# EAGLE design Valve (EAGLE 9.5.2)
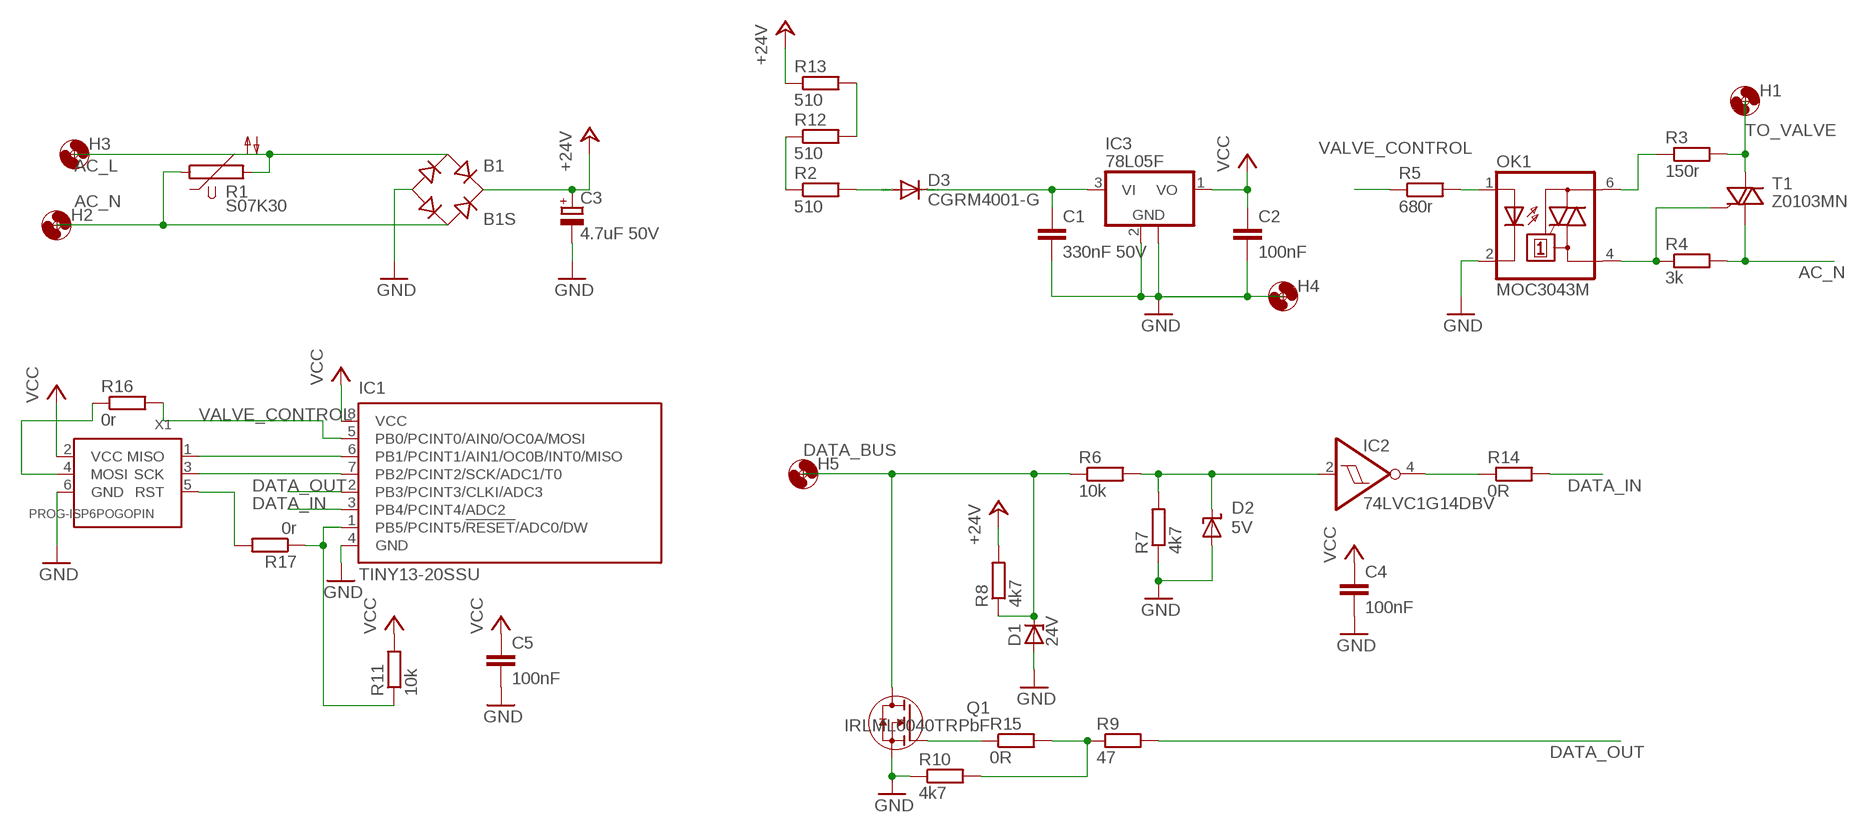
[diagram p0: schematic, sheet 1]

## Parts
B1  B1S  [MBS]
C1  330nF 50V  C-EUC0805K  [C0805K]
C2  100nF  C-EUC0805K  [C0805K]
C3  4.7uF 50V  CPOL-EUD/7343-31R  [D/7343-31R]
C4  100nF  C0805  [0805]
C5  100nF  C-EUC0805K  [C0805K]
D1  24V  ZENER-DIODESOT23  [SOT23]
D2  5V  ZENER  [SOD123]
D3  CGRM4001-G  [SOD-123_MINI-SMA]
H1  MOUNT-HOLE3.0  [3,0]
H2  MOUNT-HOLE3.0  [3,0]
H3  MOUNT-HOLE3.0  [3,0]
H4  MOUNT-HOLE3.0  [3,0]
H5  MOUNT-HOLE3.0  [3,0]
IC1  TINY13-20SSU  [8S1]
IC2  74LVC1G14DBV  [SOT23-5]
IC3  78L05F  [SOT89]
OK1  MOC3043M  [DIL06]
Q1  IRLML0040TRPbF  SI2302  [SOT-23-GSD]
R1  S07K30  S07K40  [S07K40]
R2  510  R-EU_R2512  [R2512]
R3  150r  R-EU_R0805  [R0805]
R4  3k  R-EU_R0805  [R0805]
R5  680r  R-EU_R0805  [R0805]
R6  10k  R-EU_R0805  [R0805]
R7  4k7  R-EU_R0805  [R0805]
R8  4k7  R-EU_R0805  [R0805]
R9  47  R-EU_R0805  [R0805]
R10  4k7  R-EU_R0805  [R0805]
R11  10k  R-EU_R0805  [R0805]
R12  510  R-EU_R2512  [R2512]
R13  510  R-EU_R2512  [R2512]
R14  0R  R-EU_R1206W  [R1206W]
R15  0R  R-EU_R1206W  [R1206W]
R16  0r  R0805  [0805R]
R17  0r  R0805  [0805R]
T1  Z0103MN  [SOT223]
X1  PROG-ISP6POGOPIN  [PROG_POGOPIN]

## Nets
+24V: B1.+ C3.+ R8.2 R13.1
AC_L: B1.AC1 H3.P$1 R1.2
AC_N: B1.AC2 H2.P$1 R1.1 R4.2 T1.1(A1)
DATA_BUS: D1.3(C) H5.P$1 Q1.D R6.1 R8.1
DATA_IN: IC1.3(PB4/PCINT4/ADC2) R14.2
DATA_OUT: IC1.2(PB3/PCINT3/CLKI/ADC3) R9.2
GND: B1.- C1.2 C2.2 C3.- C4.2 C5.2 D1.1(A) D2.A H4.P$1 IC1.4(GND) IC3.2(GND) IC3.2@1(GND) OK1.2(C) Q1.S R7.1 R10.1 X1.6(GND)
N$1: C1.1 D3.C IC3.3(VI)
N$2: D3.A R2.2
N$3: R12.2 R13.2
N$4: OK1.4(A1) R4.1 T1.3(G)
N$5: R2.1 R12.1
N$6: D2.C IC2.2(I) R6.2 R7.2
N$7: R9.1 R10.2 R15.2
N$8: IC1.1(PB5/PCINT5/!RESET!/ADC0/DW) R11.1 R17.1
N$9: IC2.4(O) R14.1
N$10: IC1.6(PB1/PCINT1/AIN1/OC0B/INT0/MISO) X1.1(MISO)
N$11: IC1.7(PB2/PCINT2/SCK/ADC1/T0) X1.3(SCK)
N$12: Q1.G R15.1
N$13: R16.1 X1.4(MOSI)
N$14: R17.2 X1.5(RST)
N$15: OK1.1(A) R5.2
N$16: OK1.6(A2) R3.1
TO_VALVE: H1.P$1 R3.2 T1.2(A2) T1.4(A2)
VALVE_CONTROL: IC1.5(PB0/PCINT0/AIN0/OC0A/MOSI) R5.1 R16.2
VCC: C2.1 C4.1 C5.1 IC1.8(VCC) IC3.1(VO) R11.2 X1.2(VCC)

## Power pins joined to a net without a drawn wire
GND: IC2.3(GND)
VCC: IC2.5(VCC)

## Library data of the parts
B1 = rectifier:B*S: Surface Mount Glass Passivated Bridge Rectifiers Source: Comchip Bridge Rectifiers B05S-G_B10S-G.pdf
C1 C2 C5 = rcl:C-EU: CAPACITOR, European symbol
C3 = rcl:CPOL-EU: POLARIZED CAPACITOR, European symbol
C4 = usb:C0805
D1 = diode:ZENER-DIODE: Z-Diode
D2 = usb:ZENER
D3 = diode:CGRM400*-G: Molded plasitc,JEDEC SOD-123/Mini SMA Source: Comchip CGRM4001-G.pdf
H1-H5 = holes:MOUNT-HOLE: MOUNTING HOLE with drill center marker
IC1 = atmel:TINY13: 8-bit AVR Microcontroller with 1K Bytes In-System Programmable Flash Source: http://www.atmel.com/dyn/resources/prod_documents/2535S.pdf; MPN: ATTINY13-20SSU; OC_FARNELL: 1455133; OC_NEWARK: 58M3771
IC2 = 74xx-little-de:74*1G14: Single Schmitt-Trigger Inverter Gate
IC3 = linear:78L*: POSITOIV-VOLTAGE REGULATORS Output up to 100 mA Source: Datasheet <http://focus.ti.com/lit/ds/symlink/ua78l05.pdf>
OK1 = optocoupler:MOC30*: 6-Pin DIP Zero-Cross Optoisolators Triac Driver Output (250/400 Volt Peak) Source: Data sheet <http://www.fairchildsemi.com/ds/MO/MOC3031M.pdf> The old path of data sheet not more available 2013-05-06.; MF: FAIRCHILD SEMICONDUCTOR; MPN: MOC3043-M; OC_FARNELL: 1021371; OC_NEWARK: 72K8900
Q1 = usb:SI2302: N-канальный полевик
R1 = varistor:S07K40: VARISTOR
R2-R15 = rcl:R-EU_: RESISTOR, European symbol
R16 R17 = usb:R0805
T1 = usb:Z0103MN
X1 = usb:PROG-ISP

## Board
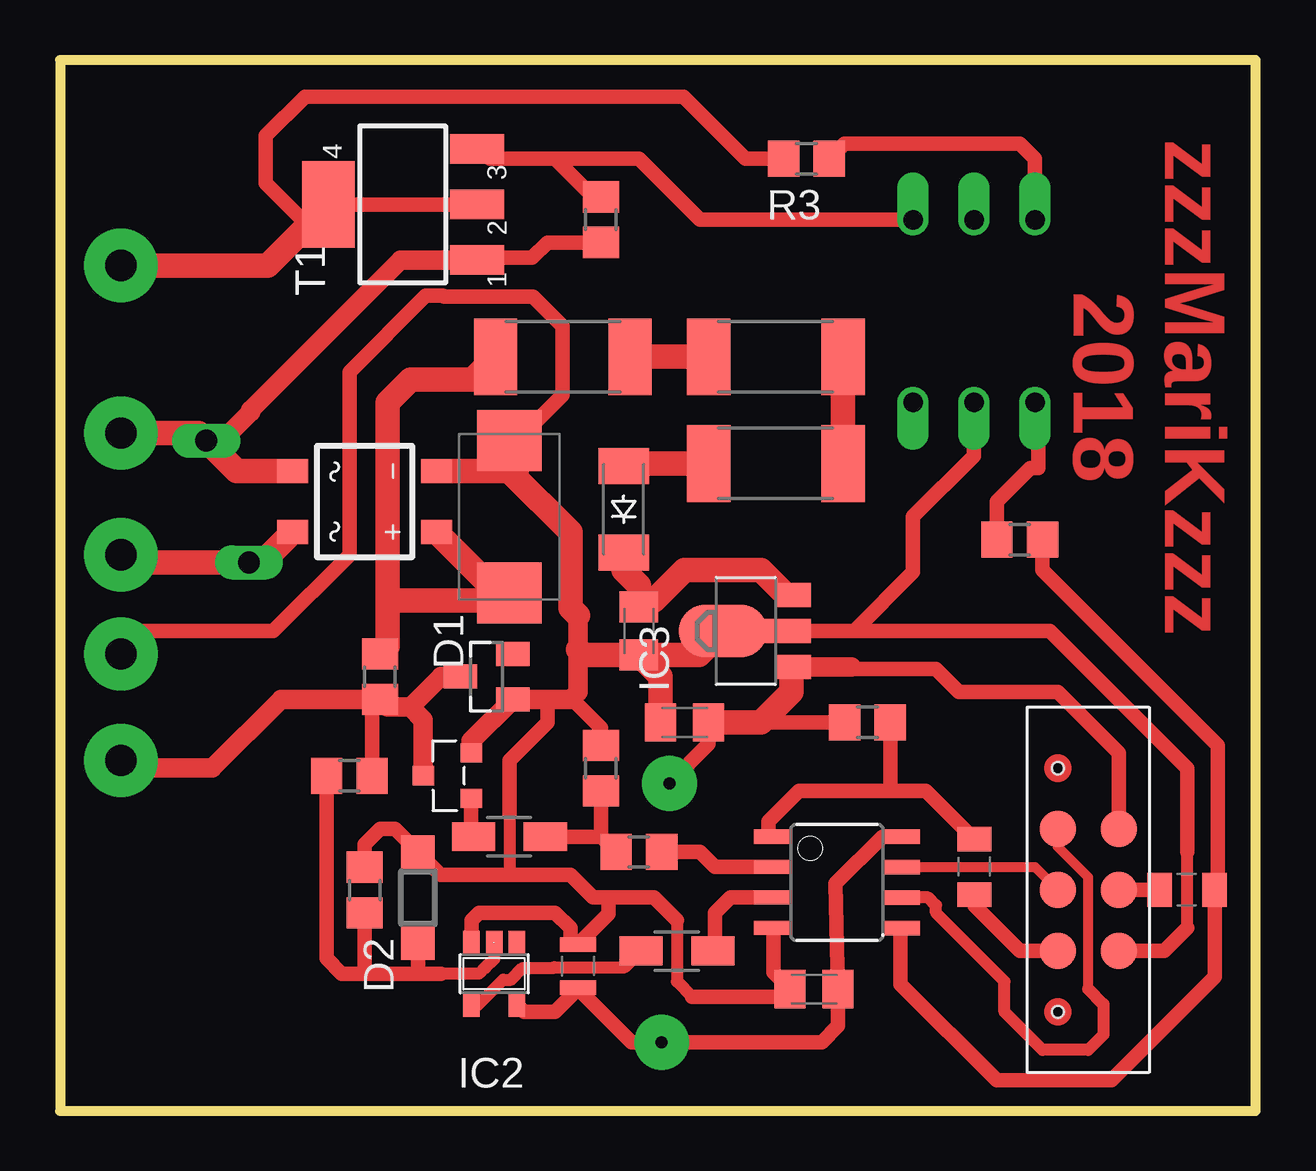
[diagram p1: board, top side]
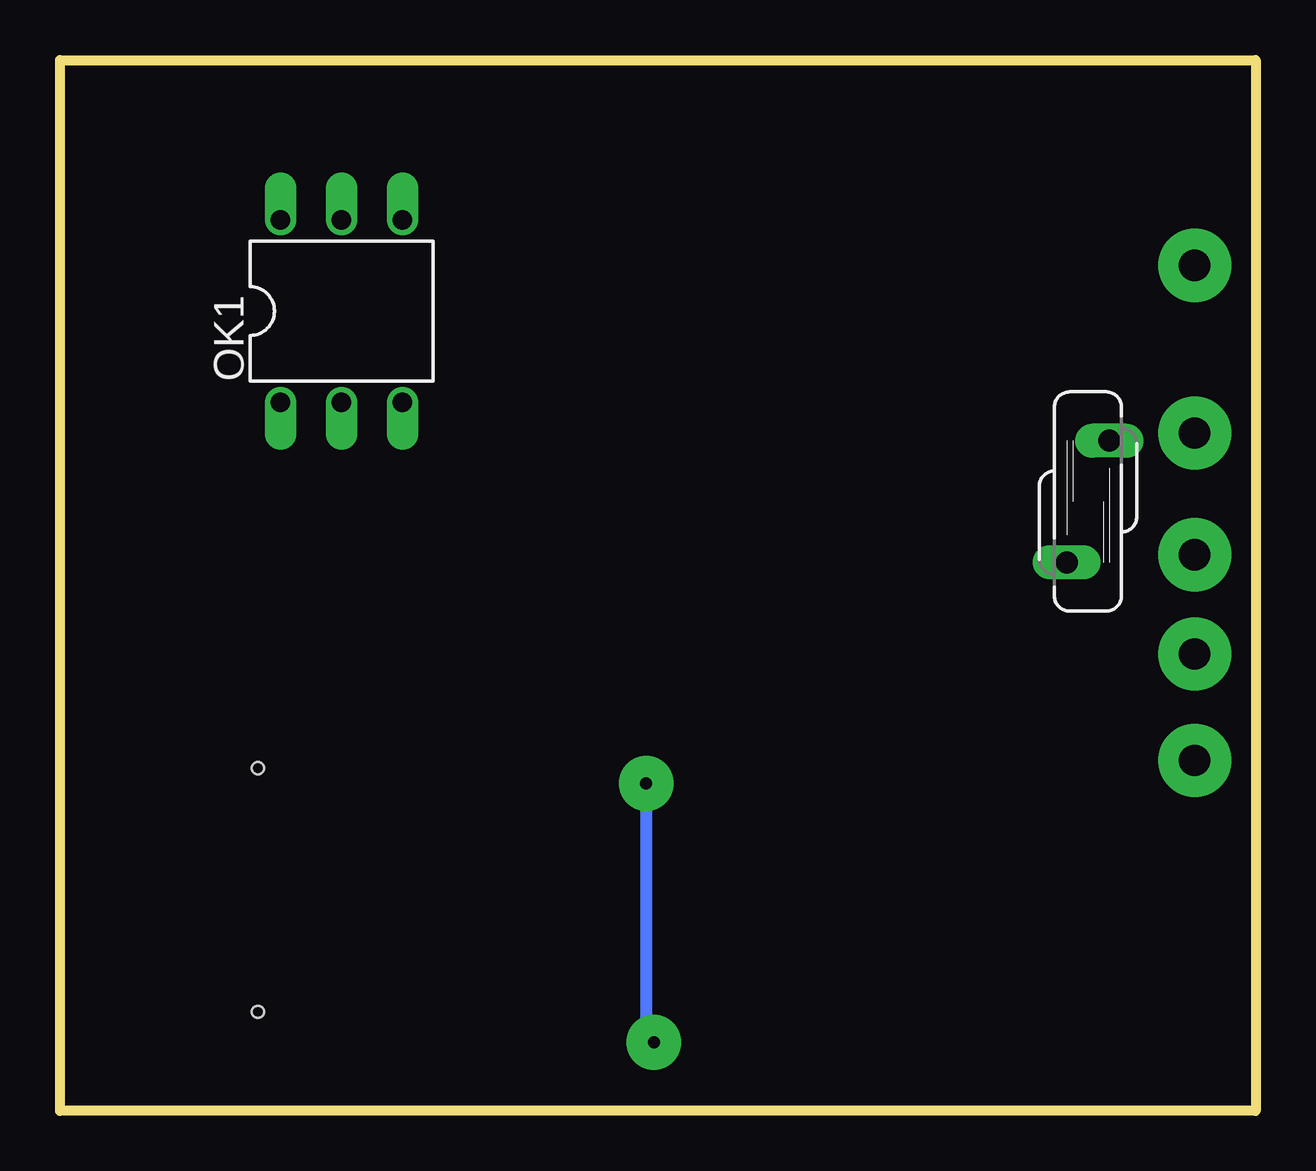
[diagram p2: board, bottom side, seen from below]

Size 49.84 x 43.8 mm. Coordinates in mm from the lower left corner, seen from the top.
Outline: 0,0 49.84,0 49.84,43.8 0,43.8 0,0
Copper layers (1*16): Top 0.035mm / dielectric 1.5mm / Bottom 0.035mm
Design rules "My": minimum track width 16mil, minimum drill 0.35mm, track to track 12mil, track to pad 12mil, pad to pad 12mil, via to via 12mil, smd to smd 12mil, copper to edge 40mil, drill to drill 24mil, minimum pad ring 10mil, minimum via ring 8mil, stop-mask expansion 4mil, vias tented up to drill 0mil, thermal gap 10mil

### Footprints (pad centres in the part's own frame; a part is rotated, then mirrored left to right if it is on the bottom)
MBS = smd 1 x 1.3: + -1.27,-3; - 1.27,-3; AC1 -1.27,3; AC2 1.27,3
C0805K = smd 1.3 x 1.6: 1 -1,0; 2 1,0
D/7343-31R = smd 2.55 x 2.7: + 3.175,0; - -3.175,0
0805 = smd 0.6 x 1.5: 1 -0.9,0; 2 0.9,0
SOT23 = smd 1 x 1.4: 1 -0.95,-1.1; 2 0.95,-1.1; 3 0,1.1
SOD123 = smd 1.4 x 1.4: A 1.9,0; C -1.9,0
SOD-123_MINI-SMA = smd 1.5 x 2.1: A 1.8,0; C -1.8,0
3,0 = drill 1.3 pad 3.048: P$1 0,0
8S1 = smd 0.6 x 1.6: 1 -1.905,-2.654; 2 -0.645,-2.654; 3 0.625,-2.654; 4 1.895,-2.654; 5 1.905,2.654; 6 0.635,2.654; 7 -0.635,2.654; 8 -1.905,2.654
SOT23-5 = smd 0.69 x 0.99: 1 -0.95,-1.29; 2 0,-1.29; 3 0.95,-1.29; 4 0.95,1.3; 5 -0.95,1.3
SOT89 = smd 1 x 1.5: 1 -1.499,-1.981; 3 1.499,-1.981 | smd 1 x 2: 2 0,-1.727 | smd 2.2 x 3.7: 2@1 0,0.94
DIL06 = drill 0.813 offset: 1 -2.54,-3.81; 2 0,-3.81; 3 2.54,-3.81; 4 2.54,3.81; 5 0,3.81; 6 -2.54,3.81
SOT-23-GSD = smd 0.8 x 0.9: D 0,2; G -0.95,0; S 0.95,0
S07K40 = drill 0.914 long: 1 -0.889,-2.54; 2 0.889,2.54
R2512 = smd 1.8 x 3.2: 1 -2.8,0; 2 2.8,0
R0805 = smd 1.3 x 1.5: 1 -0.95,0; 2 0.95,0
R1206W = smd 1.8 x 1.2: 1 -1.499,0; 2 1.499,0
0805R = smd 1.016 x 1.422: 1 -1.16,0.01; 2 1.14,0.01
SOT223 = smd 1.219 x 2.235: 1 -2.311,-3.099; 2 0,-3.099; 3 2.311,-3.099 | smd 3.6 x 2.2: 4 0,3.099
PROG_POGOPIN = smd 1.524 x 1.524: 1 0,7.62; 2 2.54,7.62; 3 0,5.08; 4 2.54,5.08; 5 0,2.54; 6 2.54,2.54 | hole 0.5: 0,0; 0,10.16

### Placement (x,y rotation side)
B1  12.7,25.4 90 top
C1  24.13,20 270 top
C2  26.04,16.19 180 top
C3  18.73,24.77 270 top
C4  21.59,6.03 90 top
C5  31.43,5.08 180 top
D1  17.78,18.1 90 top
D2  14.92,8.89 90 top
D3  23.5,25.08 90 top
H1  2.54,35.24 0 top
H2  2.54,28.26 0 top
H3  2.54,23.18 0 top
H4  2.54,19.05 0 top
H5  2.54,14.61 0 top
IC1  32.38,9.53 270 top
IC2  18.1,5.71 180 top
IC3  28.57,20 90 top
OK1  38.1,33.34 0 bottom
Q1  17.14,13.97 90 top
R1  6.99,25.4 180 bottom
R2  29.84,26.99 180 top
R3  31.11,39.69 180 top
R4  22.54,37.15 270 top
R5  40.01,23.81 180 top
R6  12.06,13.97 180 top
R7  12.7,9.21 270 top
R8  13.34,18.1 90 top
R9  24.13,10.79 0 top
R10  22.54,14.29 270 top
R11  33.66,16.19 180 top
R12  29.84,31.43 180 top
R13  20.95,31.43 0 top
R14  25.72,6.67 0 top
R15  18.73,11.43 0 top
R16  46.99,9.21 0 top
R17  38.1,10.16 270 top
T1  14.29,37.78 90 top
X1  41.59,4.13 0 top

### Tracks (layer width: path | path; a pad name or v marks a point on that pad's centre or on a via)
+24V
  Top 0.61: R8.2 13.65,19.05 | 18.72,21.27 C3.+
  Top 1.016: 13.65,21.27 13.65,29.53 14.61,30.48 17.2,30.48 R13.1 | 13.65,21.27 13.65,19.36 R8.2 | 18.23,21.61 C3.+ | 13.65,21.27 17.89,21.27 18.23,21.61 | B1.+ 18.23,21.61
AC_L
  Top 1.016: B1.AC1 8.43,22.86 R1.2 2.86,22.86 H3.P$1
AC_N
  Top 0.61: R4.2 20.32,36.2 19.68,35.56 17.48,35.56 T1.1
  Top 0.813: T1.1 14.2,35.47 7.94,29.21 7.94,29.12 6.42,27.61
  Top 1.016: H2.P$1 5.78,28.26 R1.1 | R1.1 6.35,27.94 | B1.AC2 7.37,26.67 6.42,27.61 R1.1
DATA_BUS
  Top 0.61: R6.1 13.02,16.83 R8.1
  Top 0.813: D1.3 15.88,18.1 14.61,16.83 | 14.61,16.83 13.65,16.83 R8.1 9.21,17.15 6.35,14.29 2.86,14.29 H5.P$1 | Q1.D 15.14,16.29 14.61,16.83
DATA_IN
  Top 0.61: 27.22,6.9 R14.2 27.3,6.76 27.3,8.26 27.95,8.9 IC1.3
DATA_OUT
  Top 0.61: R9.2 26.67,10.79 27.3,10.16 IC1.2
GND
  Top 0.508: 25.72,7.94 25.72,5.4 26.35,4.76 | 46.99,7.62 46.99,10.79 | 18.73,12.38 18.73,9.84
  Top 0.61: 44.45,6.35 X1.6 46.04,6.67 46.99,7.62 | IC1.4 29.73,5.78 C5.2 30.11,4.76 26.35,4.76 | 46.99,10.79 46.99,14.27 41.26,20 33.11,20 | 18.73,12.38 18.73,14.61 20.32,16.19 20.32,16.92 20.54,17.15 | 22.86,8.89 22.23,8.89 21.27,9.84 18.73,9.84 15.87,9.84 D2.A 13.96,11.75 13.34,11.75 12.7,11.11 R7.1 | 22.86,8.89 24.77,8.89 25.72,7.94 | 22.86,8.89 22.86,8.2 C4.2 21.27,7.25 21.27,7.62 20.64,8.26 17.46,8.26 17.15,7.94 IC2.3 | R10.1 22.54,15.97 21.32,17.19 | C3.- 18.73,27.62 20.95,29.84 20.95,32.7 19.72,33.93 16.02,33.93 15.98,33.97 15.24,33.97 12.06,30.8 12.06,23.18 8.89,20 3.44,20 2.54,19.1 H4.P$1 | 33.11,20 IC3.2 | OK1.2 38.1,27.3 35.56,24.77 35.56,22.45 33.11,20
  Top 0.813: 21.59,20.65 21.59,19.24 21.59,17.46 21.32,17.19 21.27,17.15 20.54,17.15 D1.1 17.14,15.41 Q1.S | IC3.2@1 IC3.2
  Top 1.016: C1.2 26.64,19 IC3.2@1 | C2.2 25.04,18.1 C1.2 | C1.2 21.82,19 21.59,19.24 | B1.- 19.04,26.67 C3.- | C3.- 19.05,26.35 | C3.- 18.75,26.66 21.27,24.13 21.27,20.97 21.59,20.65
N$1
  Top 1.016: D3.C 23.5,22.54 24.13,21.91 C1.1 24.4,21.27 24.77,21.27 26.04,22.54 29.21,22.54 30.25,21.5 IC3.3
N$2
  Top 1.016: 26.94,26.88 R2.2 23.6,26.99 D3.A
N$3
  Top 1.016: R13.2 R12.2
N$4
  Top 0.61: 20.63,39.69 17.93,39.69 T1.3 | 20.63,39.69 24.13,39.69 26.67,37.15 OK1.4 | R4.1 22.22,38.1 20.63,39.69
N$5
  Top 1.016: R12.1 R2.1
N$6
  Top 0.508: IC2.2 18.1,6.33 17.72,5.95 17.7,5.95 17.46,5.71 15.88,5.71
  Top 0.61: 15.1,5.71 15.88,5.71 | D2.C 14.92,5.89 15.1,5.71 | R6.2 11.12,6.35 11.75,5.71 12.69,5.71 | 12.69,5.71 15.1,5.71 | R7.2 12.7,5.73 12.69,5.71
N$7
  Top 0.61: 22.54,11.43 R10.2 | 22.54,11.43 R9.1 | R15.2 22.54,11.43
N$8
  Top 0.61: R17.1 36.09,13.34 34.77,13.34 | 34.77,13.34 30.8,13.34 29.53,12.06 29.53,11.63 IC1.1 | R11.1 34.6,13.5 34.77,13.34
N$9
  Top 0.508: IC2.4 17.42,4.42 18.47,5.47 18.8,5.47 19.29,5.95 20.57,5.95 20.61,5.99 23.54,5.99 R14.1
N$10
  Top 0.406: X1.1 41.59,11 42.86,9.73 42.86,5.08
  Top 0.508: 42.86,5.08 43.5,4.45 43.5,3.17 42.86,2.54 40.96,2.54 39.37,4.13 39.37,5.4 36.51,8.26 36.51,8.57 36.2,8.89 IC1.6
N$11
  Top 0.406: IC1.7 40.64,10.16 X1.3
N$12
  Top 0.61: Q1.G 17.14,11.52 R15.1
N$13
  Top 0.61: R16.1 44.14,9.22 X1.4
N$14
  Top 0.61: R17.2 38.11,8.56 40.01,6.67 X1.5
N$15
  Top 0.61: OK1.1 40.77,29.4 40.77,26.8 40.45,26.8 39.05,25.4 R5.2
N$16
  Top 0.61: OK1.6 40.64,39.69 40.01,40.32 32.7,40.32 R3.1
TO_VALVE
  Top 0.61: R3.2 28.57,39.69 25.98,42.28 10.21,42.28 8.57,40.64 8.57,38.66 10.4,36.83 T1.4 T1.2
  Top 1.016: H1.P$1 8.65,35.24 T1.4
VALVE_CONTROL
  Top 0.61: IC1.5 35.04,5.28 39.05,1.27 43.81,1.27 48.13,5.58 R16.2 48.26,9.35 48.26,15.24 40.95,22.55 R5.1
VCC  (via drill 0.5 pad 2.29)
  Top 0.61: 32.38,5.03 C5.1 | C5.1 32.33,9.47 34.29,11.43 IC1.8 | C2.1 27.04,15.29 v25.4,13.65 | 29.21,16.19 R11.2 | X1.2 44.13,14.92 41.59,17.46 37.47,17.46 36.51,18.41 33.08,18.41 32.99,18.5 | C5.1 32.43,3.54 31.75,2.86 v25.08,2.86 23.81,2.86 21.59,5.08 | 21.59,5.08 20.64,4.13 19.34,4.13 IC2.5 | C4.1 21.59,5.08
  Top 0.813: 32.99,18.5 IC3.1
  Top 1.016: C2.1 29.21,16.19 30.48,17.46 30.48,18.43 IC3.1
  Bottom 0.508: v25.4,13.65 25.4,3.17 v25.08,2.86

### Text on the board
Top: zzzMariKzzz / 2018